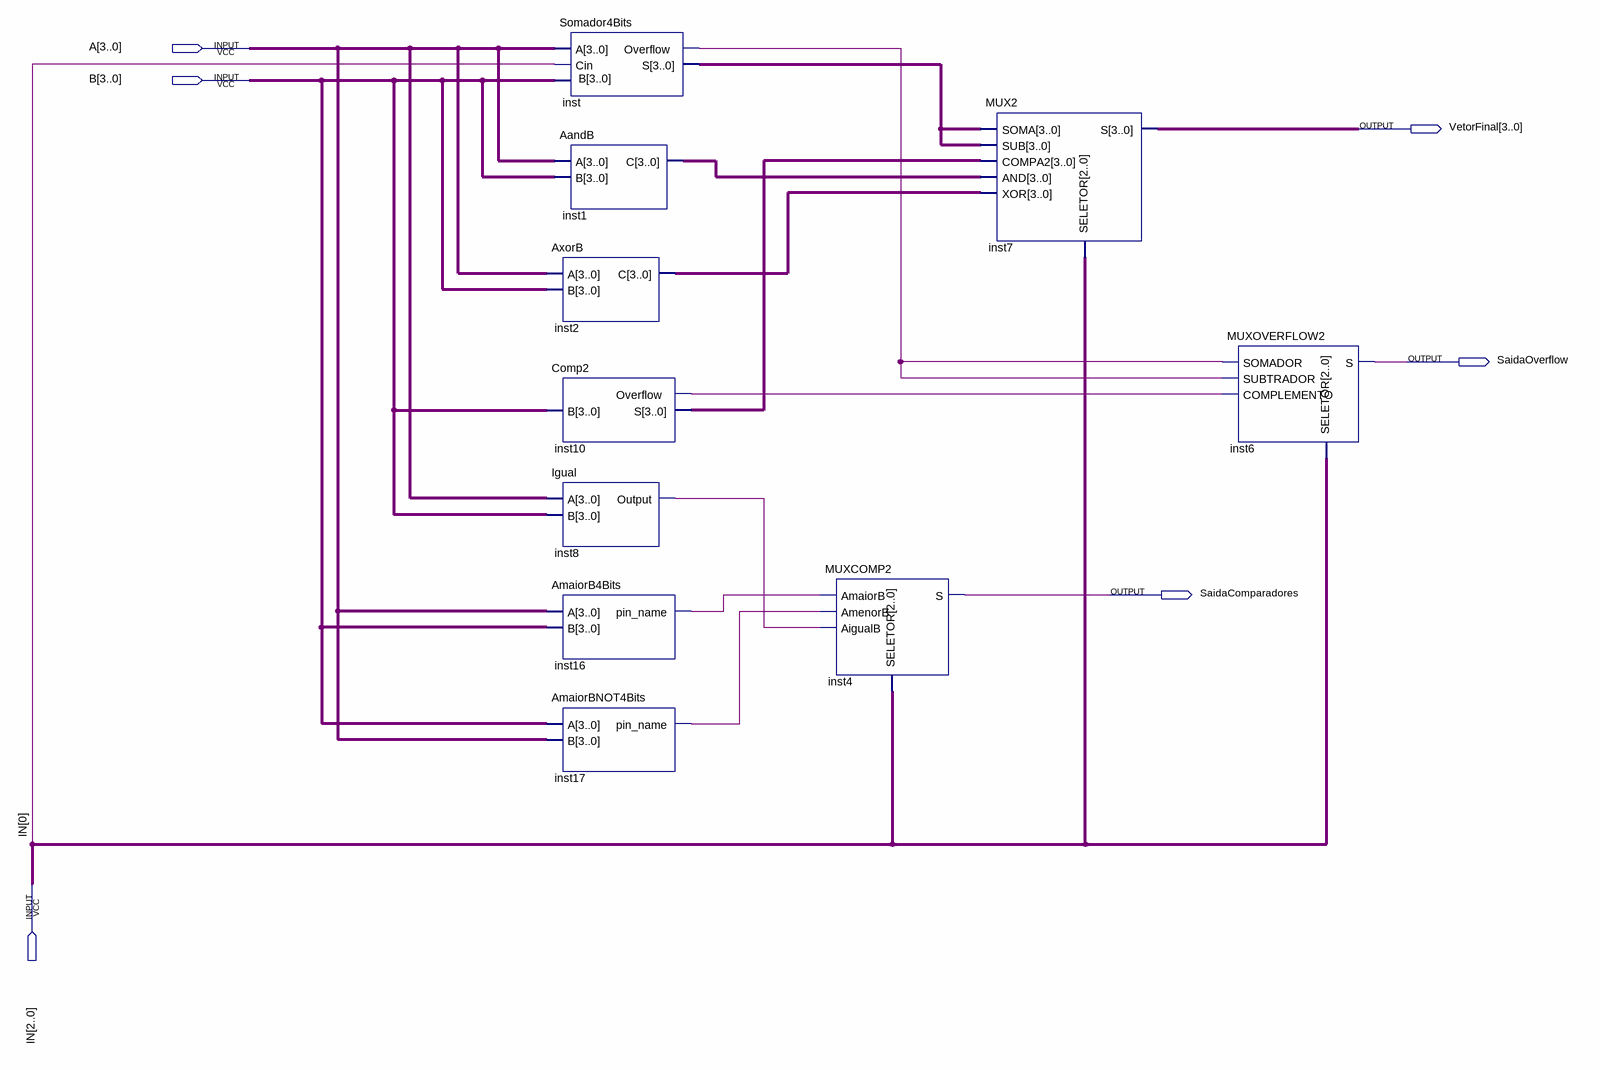
[diagram p0: schematic sheet]
// Quartus schematic MUXFINAL.bdf as structural Verilog: 10 symbols, 6 pins
module MUXFINAL (
  input  [3:0] A,
  input  [3:0] B,
  input  [2:0] IN,
  output [3:0] VetorFinal,
  output SaidaOverflow,
  output SaidaComparadores
);

  wire inst8_output, inst10_overflow, inst16_pin_name, inst17_pin_name, inst_overflow;
  wire [3:0] inst1_c, inst2_c, inst10_s, inst_s;

  Somador4Bits inst (.A(A), .B(B), .Cin(IN[0]), .Overflow(inst_overflow), .S(inst_s));
  AandB inst1 (.A(A), .B(B), .C(inst1_c));
  AxorB inst2 (.A(A), .B(B), .C(inst2_c));
  Comp2 inst10 (.B(B), .Overflow(inst10_overflow), .S(inst10_s));
  Igual inst8 (.A(A), .B(B), .Output(inst8_output));
  AmaiorB4Bits inst16 (.A(A), .B(B), .pin_name(inst16_pin_name));
  AmaiorBNOT4Bits inst17 (.A(B), .B(A), .pin_name(inst17_pin_name));
  MUXCOMP2 inst4 (
    .AmaiorB(inst16_pin_name), .AmenorB(inst17_pin_name), .AigualB(inst8_output), .SELETOR(IN),
    .S(SaidaComparadores));
  MUX2 inst7 (
    .SOMA(inst_s), .SUB(inst_s), .COMPA2(inst10_s), .AND(inst1_c), .XOR(inst2_c), .SELETOR(IN), .S(VetorFinal));
  MUXOVERFLOW2 inst6 (
    .SOMADOR(inst_overflow), .SUBTRADOR(inst_overflow), .COMPLEMENTO(inst10_overflow), .SELETOR(IN),
    .S(SaidaOverflow));
endmodule
